# EAGLE design RFBoardSchematics (EAGLE 9.2.2)
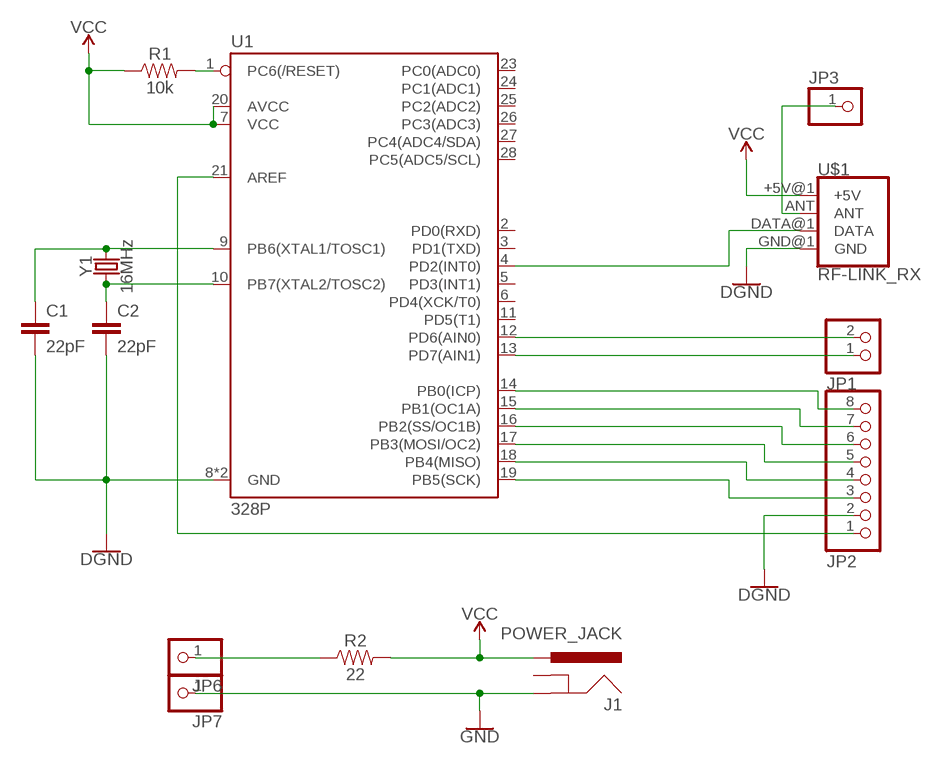
[diagram p0: schematic, sheet 1]

## Parts
C1  22pF  22PF-PTH-2.54MM-200V-5%  [CAP-PTH-2.54]
C2  22pF  22PF-PTH-2.54MM-200V-5%  [CAP-PTH-2.54]
J1  POWER_JACK  [POWER_JACK_PTH]
JP1  PINHD-1X2  [1X02]
JP2  PINHD-1X8  [1X08]
JP3  PINHD-1X1  [1X01]
JP6  PINHD-1X1  [1X01]
JP7  PINHD-1X1  [1X01]
R1  10k  10KOHM-HORIZ-1/4W-1%  [AXIAL-0.3]
R2  22  10OHM-HORIZ-1/4W-1%  [AXIAL-0.3]
U1  328P  ATMEGA328P_PDIP  [DIP28]
U$1  RF-LINK_RX  [RF-LINK_RX]
Y1  16MHz  CRYSTAL-16MHZPTH-HC49US  [HC49US]

## Nets
GND: C1.2 C2.2 J1.GND JP2.2 JP7.1 U1.8(GND) U1.22(GND) U$1.GND@1(GND) ; supply symbol labelled DGND
N$1: R1.P$2 U1.1(PC6(/RESET))
N$2: C1.1 U1.9(PB6(XTAL1/TOSC1)) Y1.2
N$3: C2.1 U1.10(PB7(XTAL2/TOSC2)) Y1.1
N$4: JP6.1 R2.P$1
N$5: JP3.1 U$1.ANT
N$6: U1.4(PD2(INT0)) U$1.DATA@1(DATA)
N$7: JP1.2 U1.12(PD6(AIN0))
N$8: JP1.1 U1.13(PD7(AIN1))
N$9: JP2.8 U1.14(PB0(ICP))
N$10: JP2.7 U1.15(PB1(OC1A))
N$11: JP2.6 U1.16(PB2(SS/OC1B))
N$12: JP2.5 U1.17(PB3(MOSI/OC2))
N$13: JP2.4 U1.18(PB4(MISO))
N$14: JP2.3 U1.19(PB5(SCK))
N$15: JP2.1 U1.21(AREF)
VCC: J1.PWR R1.P$1 R2.P$2 U1.7(VCC) U1.20(AVCC) U$1.+5V@1(+5V)
Unconnected: J1.GNDBREAK U1.2(PD0(RXD)) U1.3(PD1(TXD)) U1.5(PD3(INT1)) U1.6(PD4(XCK/T0)) U1.11(PD5(T1)) U1.23(PC0(ADC0)) U1.24(PC1(ADC1)) U1.25(PC2(ADC2)) U1.26(PC3(ADC3)) U1.27(PC4(ADC4/SDA)) U1.28(PC5(ADC5/SCL))

## Library data of the parts
C1 C2 = SparkFun-Capacitors:22PF: 22pF ceramic capacitors A capacitor is a passive two-terminal electrical component used to store electrical energy temporarily in an electric field.; PROD_ID: CAP-09128
J1 = SparkFun-Connectors:POWER_JACK: Power Jack Connector This is the standard 5.5mm barrel jack for power. The PTH is the most common, proven, reliable, footprint. The Slot footprint only works if the mill layer is transmitted to the PCB fab house so be warned. Here are the connectors we sell at SparkFun: DC Barrel Power Jack/Connector <https://www.sparkfun.com/products/119> (PRT-00119) DC Barrel Power Jack/Connector (SMD) <https://www.sparkfun.com/products/12748> (PRT-12748) DC Barrel Jack Adapter - Breadboard Compatible <https://www.sparkfun.com/products/10811> (PRT-10811) It is used on this SparkFun product (and many, many others): SparkFun RedBoard - Programmed with Arduino <https://www.sparkfun.com/products/12757> (DEV-12757) Also, if you need a mating power supply or connector, please check these out: Wall Adapter Power Supply - 9VDC 650mA <https://www.sparkfun.com/products/298> (TOL-00298) DC Barrel Jack Adapter - Male <https://www.sparkfun.com/products/10287> (PRT-10287); PROD_ID: CONN-08197
JP1 = pinhead:PINHD-1X2: PIN HEADER
JP2 = pinhead:PINHD-1X8: PIN HEADER
JP3 JP6 JP7 = pinhead:PINHD-1X1: PIN HEADER
R1 = SparkFun-Resistors:10KOHM: 10kΩ resistor A resistor is a passive two-terminal electrical component that implements electrical resistance as a circuit element. Resistors act to reduce current flow, and, at the same time, act to lower voltage levels within circuits. - Wikipedia; PROD_ID: RES-12183
R2 = SparkFun-Resistors:10OHM: 10Ω resistor A resistor is a passive two-terminal electrical component that implements electrical resistance as a circuit element. Resistors act to reduce current flow, and, at the same time, act to lower voltage levels within circuits. - Wikipedia; PROD_ID: RES-12180; VALUE: 10
U1 = SparkFun-IC-Microcontroller:ATMEGA328P_PDIP: Atmel 328P Through hole ATMEGA328P uC used in the Arduino 32kb flash, 1k EEPROM, 2k SRAM Datasheet <http://www.sparkfun.com/datasheets/Components/SMD/ATMega328.pdf> SparkFun Products Storefront component: AVR 28 Pin 20MHz 32K 6A/D - ATMega328P <https://www.sparkfun.com/products/9061> (COM-09061) SparkFun Simon Says - Through-Hole Soldering Kit <https://www.sparkfun.com/products/10547> (KIT-10547) SparkFun Learn to Solder - Simon Says <https://www.sparkfun.com/products/13708> (KIT-13708) SparkFun BigTime Watch Kit <https://www.sparkfun.com/products/11734> (KIT-11734) SparkFun ClockIt <https://www.sparkfun.com/products/10930> (KIT-10930) SparkFun Serial Enabled LCD Kit <https://www.sparkfun.com/products/10097> (LCD-10097) SparkFun Simon Tilts - Through Hole Soldering Kit <https://www.sparkfun.com/products/12634> (KIT-12634) SparkFun Frequency Counter Kit <https://www.sparkfun.com/products/10140> (KIT-10140) FabFM Radio Kit <https://www.sparkfun.com/products/11043> (KIT-11043) SparkFun Binary Blaster Kit <https://www.sparkfun.com/products/12037> (KIT-12037) SparkFun Metro-Gnome <https://www.sparkfun.com/products/9236> (KIT-09236) ATmega328 with Arduino Optiboot (Uno) <https://www.sparkfun.com/products/10524> (DEV-10524); PROD_ID: IC-09136
U$1 = SparkFun-RF:RF-LINK_RX: RF Link Receiver (434 MHz, 315 MHz) These wireless receivers work with equivalent transmitters. They can easily fit into a breadboard and work well with microcontrollers to create a very simple wireless data link. Since these are only receivers, they will only work communicating data one-way, you would need two pairs (of different frequencies) to act as a transmitter/receiver pair.. SparkFun Products RF Link Receiver - 4800bps (434 MHz) <https://www.sparkfun.com/products/10532>(WRL-10532); SF_ID: WRL-10533
Y1 = SparkFun-Clocks:CRYSTAL-16MHZ: 16MHz Crystal Digikey Example <http://www.digikey.com/product-search/en?keywords=535-9122-1-ND> Frequency: 16MHz Frequency Stability: ±50ppm Frequency Tolerance: ±20ppm Load Capacitance: 18pF SparkFun Products: Pro Micro -5V/16MHz <https://www.sparkfun.com/products/12640> SparkFun Serial Enabled LCD Kit <https://www.sparkfun.com/products/10097>; PROD_ID: XTAL-08181; SF_ID: COM-00536

## Board
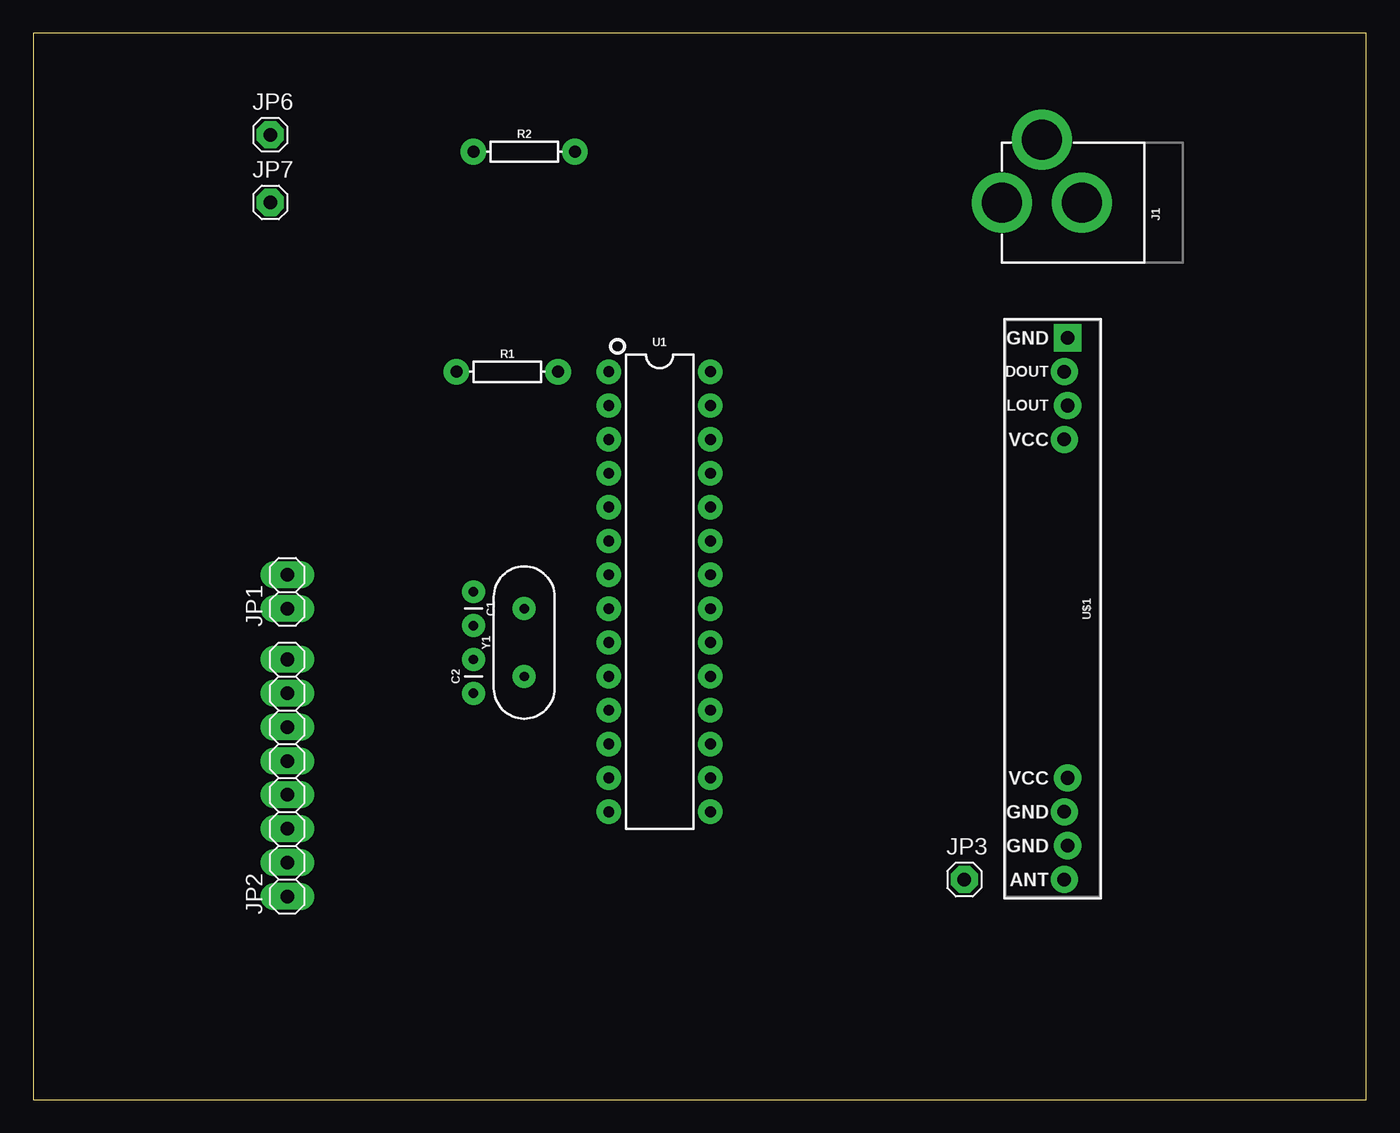
[diagram p1: board, top side]
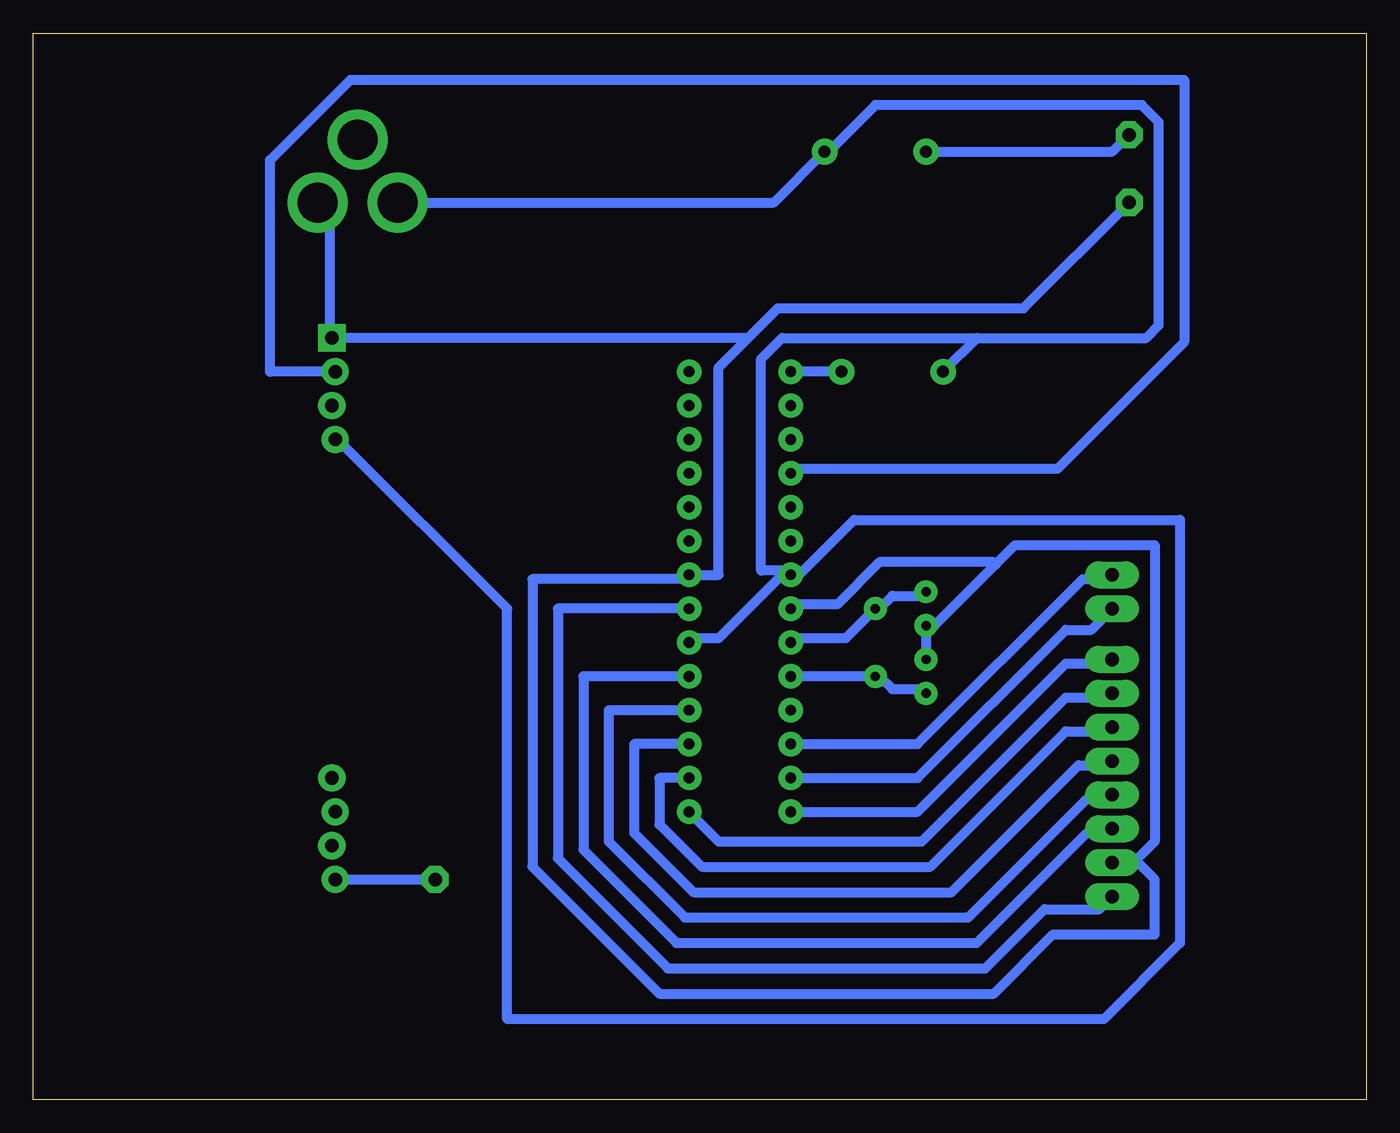
[diagram p2: board, bottom side, seen from below]

Size 100 x 80 mm. Coordinates in mm from the lower left corner, seen from the top.
Outline: 0,0 100,0 100,80 0,80 0,0
Copper layers (1*16): Top 0.035mm / dielectric 1.5mm / Bottom 0.035mm
Design rules "default *": minimum track width 30mil, minimum drill 0.35mm, track to track 40mil, track to pad 40mil, pad to pad 6mil, via to via 6mil, smd to smd 6mil, copper to edge 40mil, drill to drill 6mil, minimum pad ring 20mil, minimum via ring 8mil, stop-mask expansion 4mil, vias tented up to drill 0mil, thermal gap 10mil

### Footprints (pad centres in the part's own frame; a part is rotated, then mirrored left to right if it is on the bottom)
CAP-PTH-2.54 = drill 0.7 pad 1.651: 1 -1.27,0; 2 1.27,0
POWER_JACK_PTH = drill 2.997 pad 4.318: GND 0,7.7; GNDBREAK 4.7,10.7; PWR 0,13.7
1X02 = drill 1.016 long: 1 -1.27,0; 2 1.27,0
1X08 = drill 1.016 long: 1 -8.89,0; 2 -6.35,0; 3 -3.81,0; 4 -1.27,0; 5 1.27,0; 6 3.81,0; 7 6.35,0; 8 8.89,0
1X01 = drill 1.016 octagon: 1 0,0
AXIAL-0.3 = drill 0.9 pad 1.88: P$1 -3.81,0; P$2 3.81,0
DIP28 = drill 0.813 pad 1.626: 1 -16.51,-3.81; 2 -13.97,-3.81; 3 -11.43,-3.81; 4 -8.89,-3.81; 5 -6.35,-3.81; 6 -3.81,-3.81; 7 -1.27,-3.81; 8 1.27,-3.81; 9 3.81,-3.81; 10 6.35,-3.81; 11 8.89,-3.81; 12 11.43,-3.81; 13 13.97,-3.81; 14 16.51,-3.81; 15 16.51,3.81; 16 13.97,3.81; 17 11.43,3.81; 18 8.89,3.81; 19 6.35,3.81; 20 3.81,3.81; 21 1.27,3.81; 22 -1.27,3.81; 23 -3.81,3.81; 24 -6.35,3.81; 25 -8.89,3.81; 26 -11.43,3.81; 27 -13.97,3.81; 28 -16.51,3.81
RF-LINK_RX = drill 1.016 pad 1.88: +5V@1 -12.7,-0.127; +5V@2 12.7,0.127; ANT 20.32,-0.127; DATA@1 -17.78,-0.127; DATA@2 -15.24,0.127; GND@2 15.24,-0.127; GND@3 17.78,0.127 | drill 1.016 pad 1.88 square: GND@1 -20.32,0.127
HC49US = drill 0.7 pad 1.651: 1 -2.54,0; 2 2.54,0

### Placement (x,y rotation side)
C1  33.02,36.83 270 top
C2  33.02,31.75 90 top
J1  86.36,67.31 90 top
JP1  19.05,38.1 90 top
JP2  19.05,24.13 90 top
JP3  69.85,16.51 0 top
JP6  17.78,72.39 0 top
JP7  17.78,67.31 0 top
R1  35.56,54.61 0 top
R2  36.83,71.12 0 top
U1  46.99,38.1 270 top
U$1  77.47,36.83 270 top
Y1  36.83,34.29 90 top

### Tracks (layer width: path | path; a pad name or v marks a point on that pad's centre or on a via)
GND
  Bottom 0.762: JP2.2 18.73,18.1 17.14,18.1 | 17.14,18.1 15.88,19.37 15.88,41.59 26.35,41.59 27.78,40.16 | 27.78,40.16 32.38,35.56 C1.2 C2.2 | U1.8 42.86,37.15 39.69,37.15 36.51,40.32 27.94,40.32 27.78,40.16 | J1.GND 77.79,67.31 77.79,57.15 U$1.GND@1 46.67,57.15 46.51,56.99 | JP7.1 25.72,59.37 44.13,59.37 46.51,56.99 | 46.51,56.99 48.58,54.93 48.58,39.37 U1.22 50.8,39.05 62.55,39.05 62.55,17.46 53.02,7.94 27.94,7.94 23.5,12.38 15.88,12.38 15.88,16.51 17.14,17.78 17.14,18.1
N$1
  Bottom 0.762: R1.P$2 U1.1
N$2
  Bottom 0.762: U1.9 42.86,34.61 39.05,34.61 Y1.2 36.51,36.83 35.56,37.78 33.34,37.78 C1.1
N$3
  Bottom 0.762: U1.10 Y1.1 36.51,31.75 35.56,30.8 33.34,30.8 C2.1
N$4
  Bottom 0.762: JP6.1 19.05,71.12 R2.P$1
N$5
  Bottom 0.762: U$1.ANT JP3.1
N$6
  Bottom 0.762: U1.4 42.86,47.31 23.18,47.31 13.65,56.83 13.65,76.52 76.2,76.52 82.23,70.48 82.23,54.61 U$1.DATA@1
N$7
  Bottom 0.762: JP1.2 19.37,39.05 21.27,39.05 33.66,26.67 U1.12
N$8
  Bottom 0.762: JP1.1 20.64,35.24 22.54,35.24 33.66,24.13 U1.13
N$9
  Bottom 0.762: JP2.8 19.37,32.7 22.54,32.7 33.66,21.59 U1.14
N$10
  Bottom 0.762: JP2.7 19.37,30.16 22.54,30.16 33.34,19.37 48.58,19.37 U1.15
N$11
  Bottom 0.762: JP2.6 19.37,27.62 22.54,27.62 32.7,17.46 49.85,17.46 53.02,20.64 53.02,24.13 U1.16
N$12
  Bottom 0.762: JP2.5 19.37,25.08 21.59,25.08 31.11,15.56 50.48,15.56 54.93,20 54.93,26.67 U1.17
N$13
  Bottom 0.762: JP2.4 19.37,22.54 20.95,22.54 29.84,13.65 51.12,13.65 56.83,19.37 56.83,29.21 U1.18
N$14
  Bottom 0.762: JP2.3 19.37,20 20.95,20 29.21,11.75 51.75,11.75 58.74,18.73 58.74,31.75 U1.19
N$15
  Bottom 0.762: JP2.1 20,14.29 24.13,14.29 28.57,9.84 52.39,9.84 60.64,18.1 60.64,36.83 U1.21
VCC
  Bottom 0.762: J1.PWR 44.45,67.31 R2.P$2 40.32,71.12 36.83,74.61 16.83,74.61 15.56,73.34 15.56,58.1 16.51,57.15 29.21,57.15 | U1.20 50.48,34.61 48.58,34.61 43.81,39.37 U1.7 | 29.21,57.15 R1.P$1 | 29.21,57.15 43.81,57.15 45.4,55.56 45.4,39.69 43.81,39.69 U1.7 | U$1.+5V@1 77.15,49.53 64.45,36.83 64.45,6.03 19.68,6.03 13.97,11.75 13.97,43.5 38.42,43.5 42.55,39.37 U1.7